# EAGLE design Hex_shield (EAGLE 9.0.1)
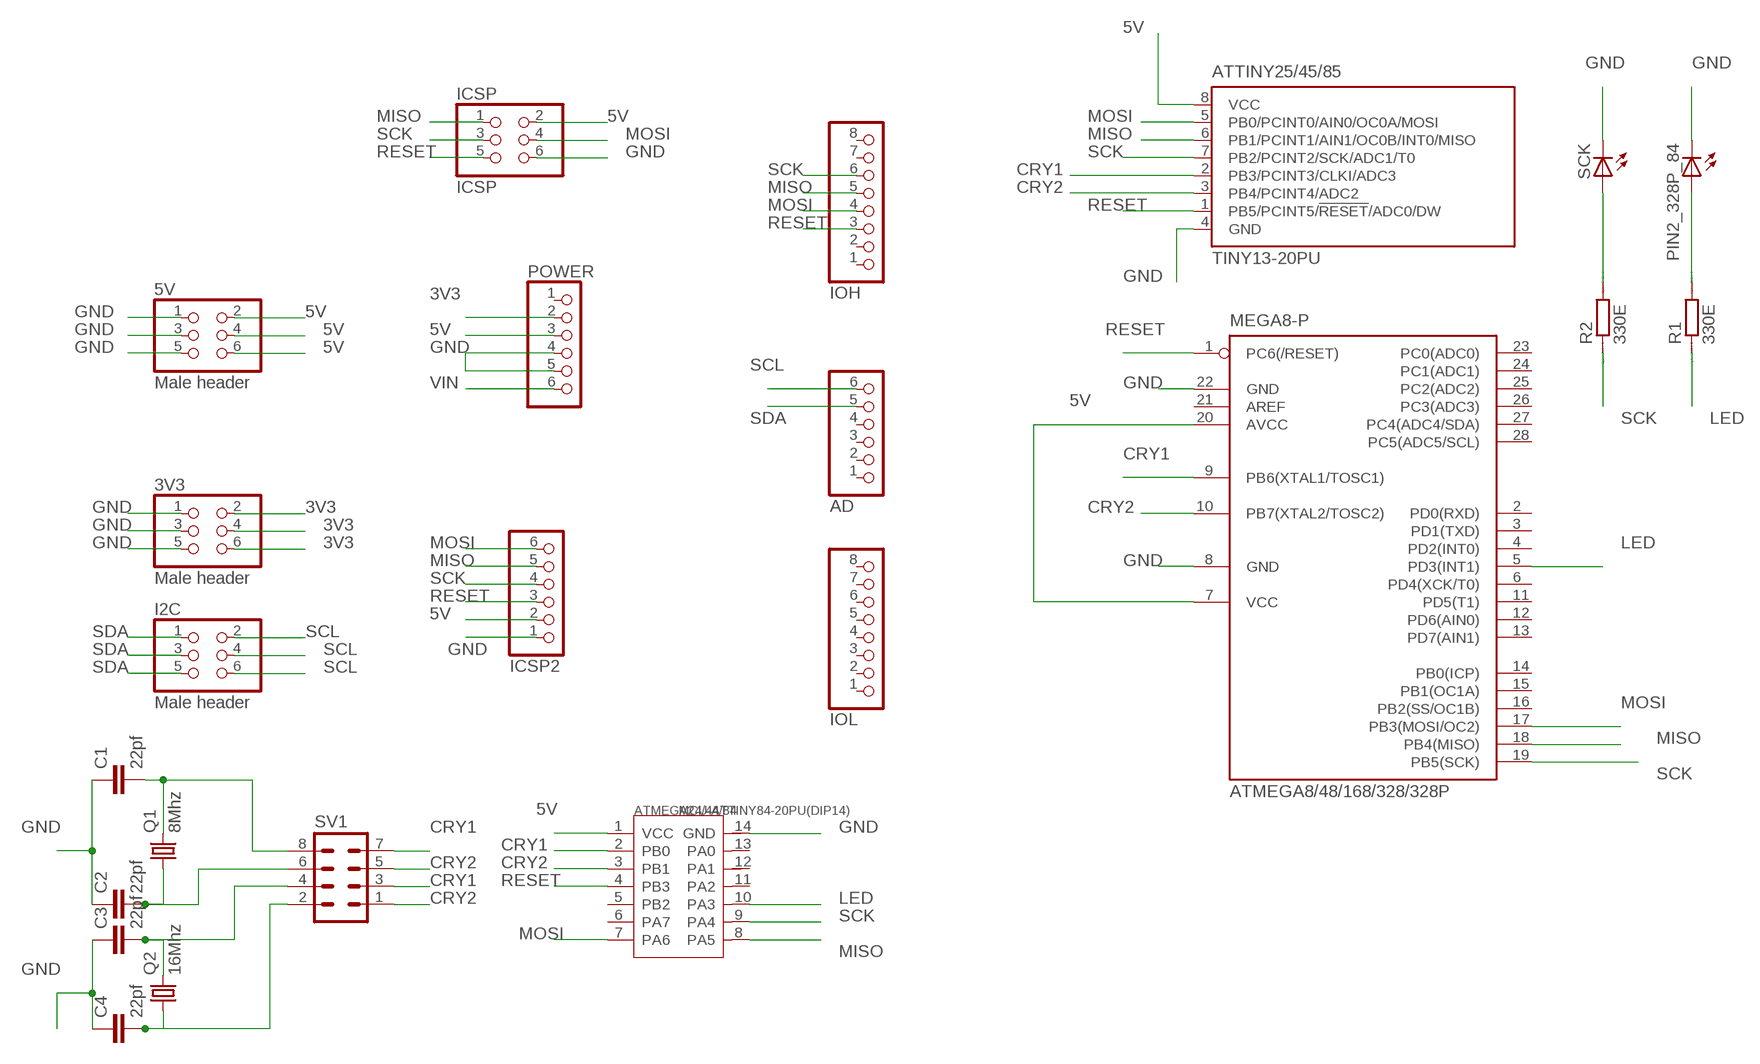
[diagram p0: schematic, sheet 1]

## Parts
3V3  Male header  PINHD-2X3  [2X03]
5V  Male header  PINHD-2X3  [2X03]
AD  PINHD-1X6  [1X06]
ATMEGA8/48/168/328/328P  MEGA8-P  [DIL28-3]
ATMEGA24/44/84  MCU-ATTINY84-20PU(DIP14)  [DIP14-2.54-17.24X6.35MM]
ATTINY25/45/85  TINY13-20PU  [DIL08]
C1  22pf  C2.5/2  [C2.5-2]
C2  22pf  C2.5/2  [C2.5-2]
C3  22pf  C2.5/2  [C2.5-2]
C4  22pf  C2.5/2  [C2.5-2]
I2C  Male header  PINHD-2X3  [2X03]
ICSP  ICSP  PINHD-2X3  [2X03]
ICSP2  PINHD-1X6  [1X06]
IOH  PINHD-1X8  [1X08]
IOL  PINHD-1X8  [1X08]
PIN2_328P_84  LED5MM  [LED5MM]
POWER  PINHD-1X6  [1X06]
Q1  8Mhz  CRYSTALHC49S  [HC49/S]
Q2  16Mhz  CRYSTALHC49S  [HC49/S]
R1  330E  R0204/7  [0204/7]
R2  330E  R0204/7  [0204/7]
SCK  LED5MM  [LED5MM]
SV1  MA04-2  [MA04-2]

## Nets
3V3: 3V3.2 3V3.4 3V3.6 POWER.2
5V: 5V.2 5V.4 5V.6 ATMEGA8/48/168/328/328P.7(VCC) ATMEGA8/48/168/328/328P.20(AVCC) ATMEGA24/44/84.1(VCC) ATTINY25/45/85.8(VCC) ICSP2.2 ICSP.2 POWER.3
CRY1: ATMEGA8/48/168/328/328P.9(PB6(XTAL1/TOSC1)) ATMEGA24/44/84.2(PB0) ATTINY25/45/85.2(PB3/PCINT3/CLKI/ADC3) SV1.3 SV1.7
CRY2: ATMEGA8/48/168/328/328P.10(PB7(XTAL2/TOSC2)) ATMEGA24/44/84.3(PB1) ATTINY25/45/85.3(PB4/PCINT4/ADC2) SV1.1 SV1.5
GND: 3V3.1 3V3.3 3V3.5 5V.1 5V.3 5V.5 ATMEGA8/48/168/328/328P.8(GND) ATMEGA8/48/168/328/328P.22(GND) ATMEGA24/44/84.14(GND) ATTINY25/45/85.4(GND) C1.1 C2.1 C3.1 C4.1 ICSP2.1 ICSP.6 PIN2_328P_84.K(C) POWER.4 POWER.5 SCK.K(C)
LED: ATMEGA8/48/168/328/328P.5(PD3(INT1)) ATMEGA24/44/84.10(PA3) R1.1
MISO: ATMEGA8/48/168/328/328P.18(PB4(MISO)) ATMEGA24/44/84.8(PA5) ATTINY25/45/85.6(PB1/PCINT1/AIN1/OC0B/INT0/MISO) ICSP2.5 ICSP.1 IOH.5
MOSI: ATMEGA8/48/168/328/328P.17(PB3(MOSI/OC2)) ATMEGA24/44/84.7(PA6) ATTINY25/45/85.5(PB0/PCINT0/AIN0/OC0A/MOSI) ICSP2.6 ICSP.4 IOH.4
N$1: C3.2 Q2.2 SV1.4
N$2: C4.2 Q2.1 SV1.2
N$3: R2.2 SCK.A
N$4: PIN2_328P_84.A R1.2
N$5: C1.2 Q1.2 SV1.8
N$6: C2.2 Q1.1 SV1.6
RESET: ATMEGA8/48/168/328/328P.1(PC6(/RESET)) ATMEGA24/44/84.4(PB3) ATTINY25/45/85.1(PB5/PCINT5/!RESET!/ADC0/DW) ICSP2.3 ICSP.5 IOH.3
SCK: ATMEGA8/48/168/328/328P.19(PB5(SCK)) ATMEGA24/44/84.9(PA4) ATTINY25/45/85.7(PB2/PCINT2/SCK/ADC1/T0) ICSP2.4 ICSP.3 IOH.6 R2.1
SCL: AD.6 I2C.2 I2C.4 I2C.6
SDA: AD.5 I2C.1 I2C.3 I2C.5
VIN: POWER.6
Unconnected: AD.1 AD.2 AD.3 AD.4 ATMEGA8/48/168/328/328P.2(PD0(RXD)) ATMEGA8/48/168/328/328P.3(PD1(TXD)) ATMEGA8/48/168/328/328P.4(PD2(INT0)) ATMEGA8/48/168/328/328P.6(PD4(XCK/T0)) ATMEGA8/48/168/328/328P.11(PD5(T1)) ATMEGA8/48/168/328/328P.12(PD6(AIN0)) ATMEGA8/48/168/328/328P.13(PD7(AIN1)) ATMEGA8/48/168/328/328P.14(PB0(ICP)) ATMEGA8/48/168/328/328P.15(PB1(OC1A)) ATMEGA8/48/168/328/328P.16(PB2(SS/OC1B)) ATMEGA8/48/168/328/328P.21(AREF) ATMEGA8/48/168/328/328P.23(PC0(ADC0)) ATMEGA8/48/168/328/328P.24(PC1(ADC1)) ATMEGA8/48/168/328/328P.25(PC2(ADC2)) ATMEGA8/48/168/328/328P.26(PC3(ADC3)) ATMEGA8/48/168/328/328P.27(PC4(ADC4/SDA)) ATMEGA8/48/168/328/328P.28(PC5(ADC5/SCL)) ATMEGA24/44/84.5(PB2) ATMEGA24/44/84.6(PA7) ATMEGA24/44/84.11(PA2) ATMEGA24/44/84.12(PA1) ATMEGA24/44/84.13(PA0) IOH.1 IOH.2 IOH.7 IOH.8 IOL.1 IOL.2 IOL.3 IOL.4 IOL.5 IOL.6 IOL.7 IOL.8 POWER.1

## Library data of the parts
3V3 5V I2C ICSP = pinhead:PINHD-2X3: PIN HEADER
AD ICSP2 POWER = pinhead:PINHD-1X6: PIN HEADER
ATMEGA8/48/168/328/328P = atmel:MEGA8-P: MICROCONTROLLER 8 Kbytes FLASH, 1 kbytes SRAM, 512 bytes EEPROM, USART, 4-channel 10 bit ADC, 2-channel 8 bit ADC Pin compatible with Atmega48, ATMega88, ATMega168 Source: avr.lbr; OC_FARNELL: unknown; OC_NEWARK: unknown
ATMEGA24/44/84 = MCU-ATTINY84-20PU_DIP14_:MCU-ATTINY84-20PU(DIP14): 310010126 Check prices <https://pricing.snapeda.com/parts/ATTINY84-20PU/Microchip/view-part?ref=eda>; AVAILABILITY: In Stock; DESCRIPTION: AVR AVR® ATtiny Microcontroller IC 8-Bit 20MHz 8KB (4K x 16) FLASH 14-PDIP; MF: Microchip; MP: ATTINY84-20PU; PACKAGE: DIP-14 Microchip; PRICE: None
ATTINY25/45/85 = atmel:TINY13: 8-bit AVR Microcontroller with 1K Bytes In-System Programmable Flash Source: http://www.atmel.com/dyn/resources/prod_documents/2535S.pdf; MPN: ATTINY13-20PU; OC_FARNELL: 9171550; OC_NEWARK: 96K6521
C1-C4 = capacitor-wima:C: CAPACITOR naming: grid - package width
IOH IOL = pinhead:PINHD-1X8: PIN HEADER
PIN2_328P_84 SCK = led:LED: LED OSRAM: - CHIPLED LG R971, LG N971, LY N971, LG Q971, LY Q971, LO R971, LY R971 LH N974, LH R974 LS Q976, LO Q976, LY Q976 LO Q996 - Hyper CHIPLED LW Q18S LB Q993, LB Q99A, LB R99A - SideLED LS A670, LO A670, LY A670, LG A670, LP A670 LB A673, LV A673, LT A673, LW A673 LH A674 LY A675 LS A676, LA A676, LO A676, LY A676, LW A676 LS A679, LY A679, LG A679 - Hyper Micro SIDELED® LS Y876, LA Y876, LO Y876, LY Y876 LT Y87S - SmartLED LW L88C, LW L88S LB L89C, LB L89S, LG L890 LS L89K, LO L89K, LY L89K LS L896, LA L896, LO L896, LY L896 - TOPLED LS T670, LO T670, LY T670, LG T670, LP T670 LSG T670, LSP T670, LSY T670, LOP T670, LYG T670 LG T671, LOG T671, LSG T671 LB T673, LV T673, LT T673, LW T673 LH T674 LS T676, LA T676, LO T676, LY T676, LB T676, LH T676, LSB T676, LW T676 LB T67C, LV T67C, LT T67C, LS T67K, LO T67K, LY T67K, LW E67C LS E67B, LA E67B, LO E67B, LY E67B, LB E67C, LV E67C, LT E67C LW T67C LS T679, LY T679, LG T679 LS T770, LO T770, LY T770, LG T770, LP T770 LB T773, LV T773, LT T773, LW T773 LH T774 LS E675, LA E675, LY E675, LS T675 LS T776, LA T776, LO T776, LY T776, LB T776 LHGB T686 LT T68C, LB T68C - Hyper Mini TOPLED® LB M676 - Mini TOPLED Santana® LG M470 LS M47K, LO M47K, LY M47K Source: http://www.osram.convergy.de LUXEON: - LUMILED® LXK2-PW12-R00, LXK2-PW12-S00, LXK2-PW14-U00, LXK2-PW14-V00 LXK2-PM12-R00, LXK2-PM12-S00, LXK2-PM14-U00 LXK2-PE12-Q00, LXK2-PE12-R00, LXK2-PE12-S00, LXK2-PE14-T00, LXK2-PE14-U00 LXK2-PB12-K00, LXK2-PB12-L00, LXK2-PB12-M00, LXK2-PB14-N00, LXK2-PB14-P00, LXK2-PB14-Q00 LXK2-PR12-L00, LXK2-PR12-M00, LXK2-PR14-Q00, LXK2-PR14-R00 LXK2-PD12-Q00, LXK2-PD12-R00, LXK2-PD12-S00 LXK2-PH12-R00, LXK2-PH12-S00 LXK2-PL12-P00, LXK2-PL12-Q00, LXK2-PL12-R00 Source: www.luxeon.com KINGBRIGHT: KA-3528ASYC Source: www.kingbright.com
Q1 Q2 = crystal:CRYSTAL: CRYSTAL; OC_FARNELL: 1667008; OC_NEWARK: unknown
R1 R2 = eagle-ltspice:R: RESISTOR, European symbol; SPICEMODEL: NONE; SPICEPREFIX: R
SV1 = con-lstb:MA04-2: PIN HEADER; OC_FARNELL: unknown; OC_NEWARK: unknown

## Net classes
0 default: width 0.152 mm, clearance 0.152 mm
1 power: width 0.406 mm, drill 0.61 mm, clearance 0.152 mm
2 gnd: width 0.203 mm, drill 0.559 mm, clearance 0.152 mm
3 usbvcc: width 0.203 mm, drill 0.61 mm, clearance 0.152 mm
4 aref: width 0.203 mm, drill 0.61 mm, clearance 0.152 mm

## Board
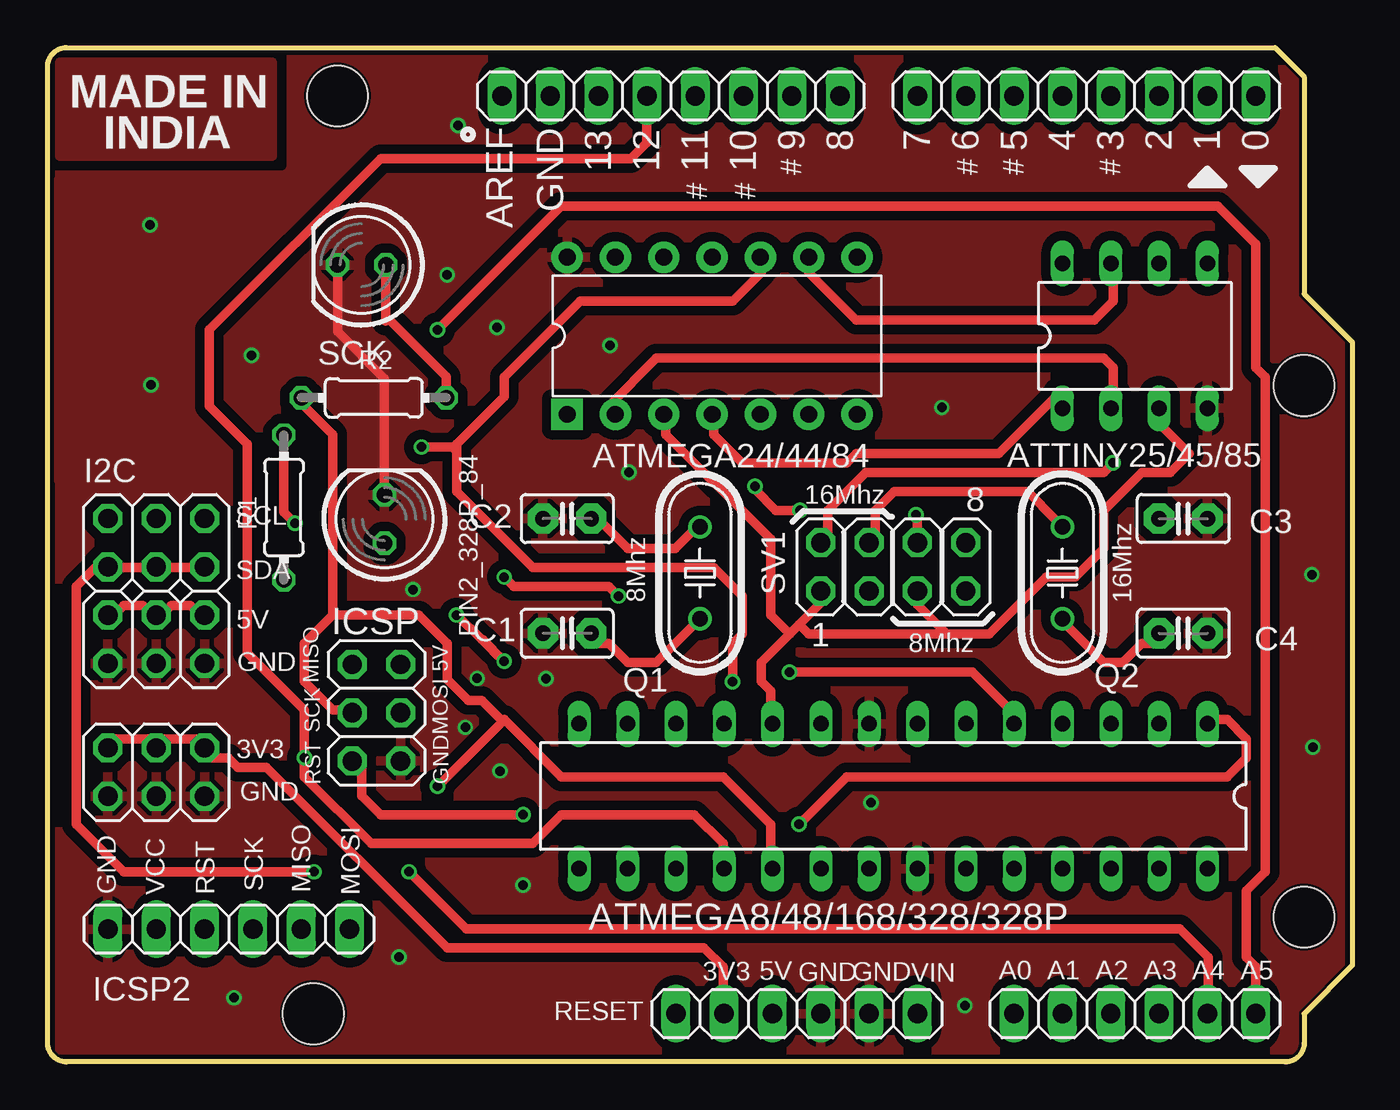
[diagram p1: board, top side]
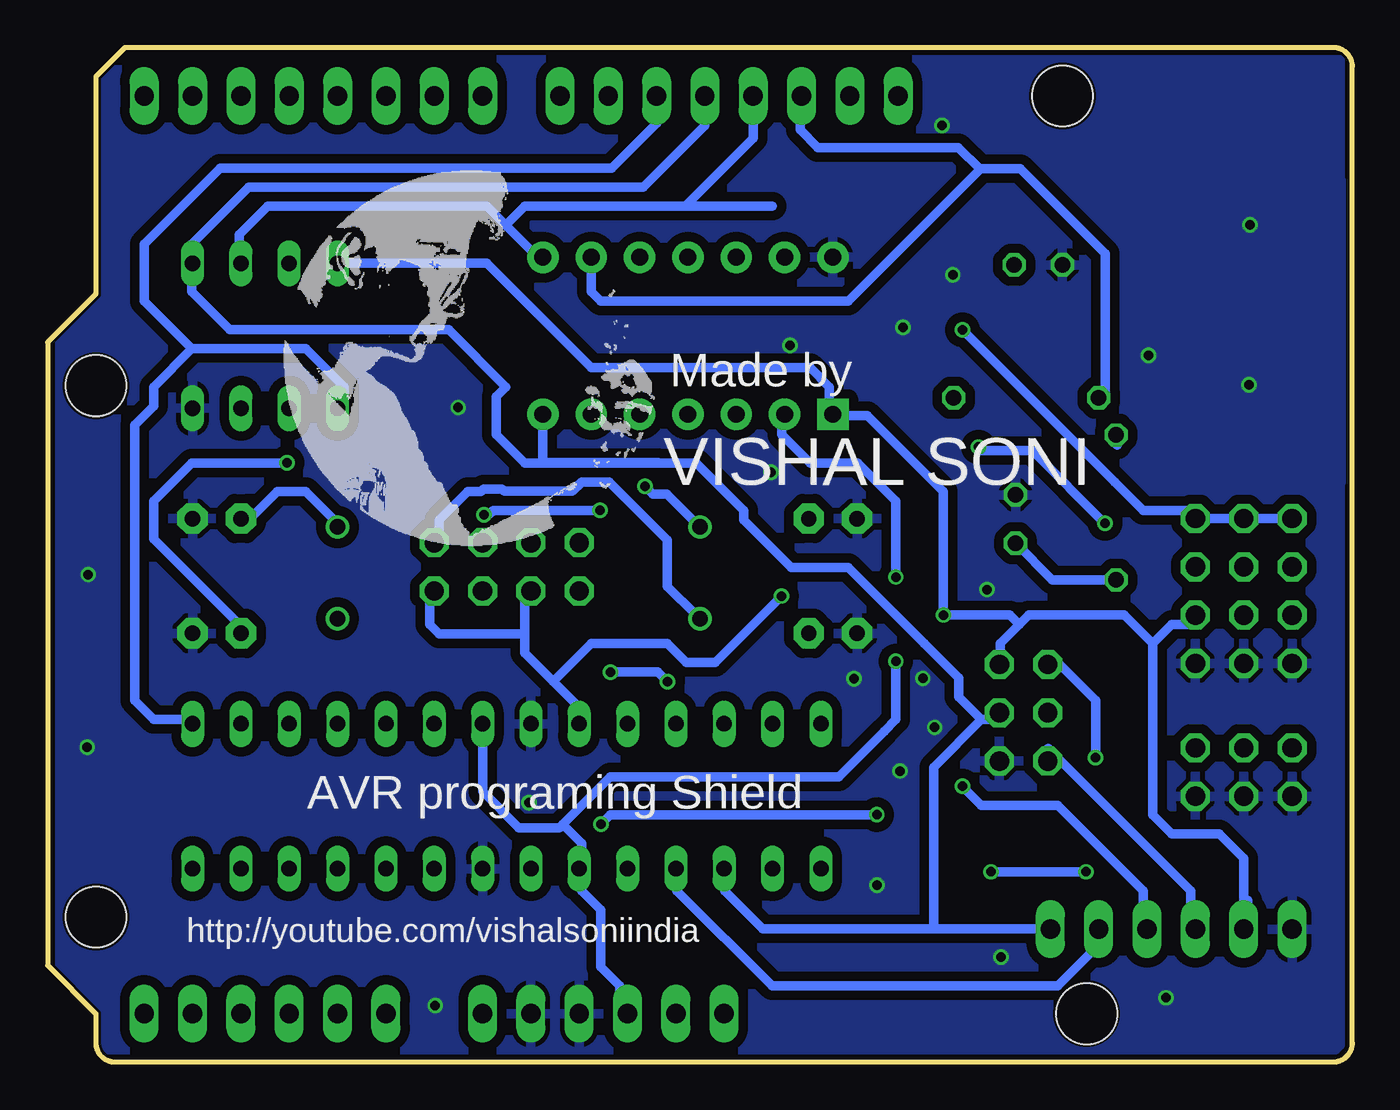
[diagram p2: board, bottom side, seen from below]

Size 68.58 x 53.34 mm. Coordinates in mm from the lower left corner, seen from the top.
Outline: 64.52,53.34 66.04,51.82 66.04,40.39 68.58,37.85 68.58,5.08 66.04,2.54 66.04,1 arc-90 65.04,0 1,0 arc-90 0,1 0,52.34 arc-90 1,53.34 64.52,53.34
Copper layers (1*16): Top 0.035mm / dielectric 1.5mm / Bottom 0.035mm
Design rules "default *": minimum track width 0.5mm, minimum drill 0.5mm, track to track 0.5mm, track to pad 0.5mm, pad to pad 0.5mm, via to via 0.5mm, smd to smd 6mil, copper to edge 6mil, drill to drill 6mil, minimum pad ring 6mil, minimum via ring 6mil, stop-mask expansion 1mil, vias tented up to drill 20mil, thermal gap 10mil
Holes 3.2 mm at 66.04,35.56 66.04,7.62 15.24,50.8 13.97,2.54
vRestrict: area 22.9,44.1 to 24.6,49.1; area 25.4,45.5 to 27.1,49.1; area 28.4,45.3 to 29.6,48.8; area 31,45.3 to 32.1,48.8; area 33.5,45.3 to 34.7,48.8; area 36.1,45.3 to 37.2,48.8; area 38.7,47.2 to 39.9,48.8; area 40.3,45.1 to 47.6,46.9; area 60.3,44.2 to 61.7,46.7; area 62.9,44.2 to 64.3,46.7; area 61.3,35.8 to 64.8,37.2; area 0.6,21.8 to 2,30.1; 14 more areas

### Footprints (pad centres in the part's own frame; a part is rotated, then mirrored left to right if it is on the bottom)
2X03 = drill 1.016 octagon: 1 -2.54,-1.27; 2 -2.54,1.27; 3 0,-1.27; 4 0,1.27; 5 2.54,-1.27; 6 2.54,1.27
1X06 = drill 1.016 long: 1 -6.35,0; 2 -3.81,0; 3 -1.27,0; 4 1.27,0; 5 3.81,0; 6 6.35,0
DIL28-3 = drill 0.813 long: 1 -16.51,-3.81; 2 -13.97,-3.81; 3 -11.43,-3.81; 4 -8.89,-3.81; 5 -6.35,-3.81; 6 -3.81,-3.81; 7 -1.27,-3.81; 8 1.27,-3.81; 9 3.81,-3.81; 10 6.35,-3.81; 11 8.89,-3.81; 12 11.43,-3.81; 13 13.97,-3.81; 14 16.51,-3.81; 15 16.51,3.81; 16 13.97,3.81; 17 11.43,3.81; 18 8.89,3.81; 19 6.35,3.81; 20 3.81,3.81; 21 1.27,3.81; 22 -1.27,3.81; 23 -3.81,3.81; 24 -6.35,3.81; 25 -8.89,3.81; 26 -11.43,3.81; 27 -13.97,3.81; 28 -16.51,3.81
DIP14-2.54-17.24X6.35MM = drill 0.889 pad 1.651 square: 1 -7.62,-4.128 | drill 0.889 pad 1.651: 2 -5.08,-4.128; 3 -2.54,-4.128; 4 0,-4.128; 5 2.54,-4.128; 6 5.08,-4.128; 7 7.62,-4.128; 8 7.62,4.128; 9 5.08,4.128; 10 2.54,4.128; 11 0,4.128; 12 -2.54,4.128; 13 -5.08,4.128; 14 -7.62,4.128
DIL08 = drill 0.813 long: 1 -3.81,-3.81; 2 -1.27,-3.81; 3 1.27,-3.81; 4 3.81,-3.81; 5 3.81,3.81; 6 1.27,3.81; 7 -1.27,3.81; 8 -3.81,3.81
C2.5-2 = drill 0.813 pad 1.6 octagon: 1 -1.27,0; 2 1.27,0
1X08 = drill 1.016 long: 1 -8.89,0; 2 -6.35,0; 3 -3.81,0; 4 -1.27,0; 5 1.27,0; 6 3.81,0; 7 6.35,0; 8 8.89,0
LED5MM = drill 0.813 octagon: A -1.27,0; K 1.27,0
HC49/S = drill 0.813: 1 -2.413,0; 2 2.413,0
0204/7 = drill 0.813 octagon: 1 -3.81,0; 2 3.81,0
MA04-2 = drill 1.016 octagon: 1 -3.81,-1.27; 2 -3.81,1.27; 3 -1.27,-1.27; 4 -1.27,1.27; 5 1.27,-1.27; 6 1.27,1.27; 7 3.81,-1.27; 8 3.81,1.27

### Placement (x,y rotation side)
3V3  5.71,15.24 0 top
5V  5.71,22.23 0 top
AD  57.15,2.54 0 top
ATMEGA8/48/168/328/328P  44.45,13.97 180 top
ATMEGA24/44/84  34.92,38.18 0 top
ATTINY25/45/85  57.15,38.18 0 top
C1  27.3,22.54 0 top
C2  27.3,28.57 0 top
C3  59.69,28.57 180 top
C4  59.69,22.54 180 top
I2C  5.71,27.3 0 top
ICSP  17.29,18.36 270 top
ICSP2  9.53,6.99 0 top
IOH  32.77,50.8 180 top
IOL  54.61,50.8 180 top
PIN2_328P_84  17.7,28.55 90 top
POWER  39.37,2.54 0 top
Q1  34.29,25.72 270 top
Q2  53.34,25.72 90 top
R1  12.42,29.16 270 top
R2  17.14,34.92 0 top
SCK  16.51,41.91 180 top
SV1  44.45,26.04 0 top

### Tracks (layer width: path | path; a pad name or v marks a point on that pad's centre or on a via)
3V3
  Top 0.5: 3V3.2 3.5,17 5.5,17 3V3.4 6,17 8,17 3V3.6 8,16.5 8.5,16 9.5,16 10,15.5 11.5,15.5 21,6 34.5,6 35.5,5 35.5,3 POWER.2
5V  (via drill 0.5)
  Top 0.5: 5V.2 3.5,23.5 4,24 5,24 5.5,23.5 5V.4 6,23.5 6.5,24 7.5,24 8,23.5 5V.6 | v21.5,23.5 22.83,22.2 23.41,21.64 v24,21.07
  Top 0.508: 22.83,22.2 22.86,22.2 v24,21.07
  Bottom 0.5: ATTINY25/45/85.8 53,42 45.5,42 40,36.5 28.5,36.5 27.5,35.5 27.5,34.5 ATMEGA24/44/84.1 27,34 25.5,34 21.5,30 v21.5,23.5 18,23.5 17.5,23 | POWER.3 38.5,3 38.5,4 39.5,5 39.5,8 40.5,9 40.5,10 ATMEGA8/48/168/328/328P.20 40.5,10.5 40.5,11.5 41.5,12.5 39,15 27,15 24.61,17.39 | 46,17.5 ATMEGA8/48/168/328/328P.7 | 5.5,8.5 5.5,7 ICSP2.2 | 7,12 9.5,12 10.5,13 10.5,22 | 10.5,22 9.5,23 8.5,23 5V.6 | 17.5,23 17,23.5 12,23.5 10.5,22 | 17.5,23 18.5,22 18.5,21 ICSP.2 | 24,18 24.61,17.39 | v24,21.07 24,18 | 24,18 | 24.61,17.39
  Bottom 0.508: ATMEGA8/48/168/328/328P.7 45.72,14.22 43.82,12.32 41.68,12.32 41.5,12.5 | ICSP2.2 5.71,10.71 7,12
CRY1  (via drill 0.5)
  Top 0.5: ATTINY25/45/85.2 56,34.5 56,36.5 55.5,37 32,37 29.5,34.5 ATMEGA24/44/84.2 | v30,24.5 29.5,25 24.5,25 v24,25.5
  Bottom 0.5: 42,20 43.5,21.5 43.5,22.5 | 42,20 40.5,18.5 40.5,18 ATMEGA8/48/168/328/328P.9 | 43.5,22.5 43.5,24.5 SV1.3 | 43.5,22.5 48,22.5 48.5,23 48.5,24.5 SV1.7 | 42,20 40,22 36,22 35,21 33.5,21 v30,24.5 | v24,25.5 24,29.5 26,31.5 28.5,31.5 30,33 30,34 ATMEGA24/44/84.2
CRY2
  Top 0.5: 47,22.5 47.27,22.5 49.5,22.5 52.5,25.5 54,25.5 55.5,27 55.5,29 57.5,31 59,31 60,32 58.5,33.5 58.5,34 ATTINY25/45/85.3 | 39.5,23 41,24.5 SV1.1 | 39.5,23 39,22.5 | 39,22.5 37.5,21 37.5,20 38,19.5 38,18 ATMEGA8/48/168/328/328P.10 | 39,22.5 38,23.5 38,27.5 32.5,33 32.5,34 ATMEGA24/44/84.3 | 46,22.5 45.72,22.5 40,22.5 39.5,23
  Top 0.508: 45.72,22.5 47,22.5 | SV1.5 45.72,24.05 47.27,22.5
GND  (via drill 0.5)
  Top 0.508: PIN2_328P_84.K 17.7,35.94 15.24,38.41 SCK.K
  other vias: 21.96,17.59 21.56,49.24 21,41.39 29.55,37.68 30.57,31.01 26.2,20.15 23.77,15.3 47,34.41 9.8,3.38 18.47,5.51 66.45,25.63 66.5,16.56 48.21,2.97 43.28,13.64 24.99,9.3 19.2,24.84 22.58,20.17 5.38,44.02 5.44,35.61 23.62,38.63 10.72,37.16
  pour Bottom (rank 2): 0.64,52.7 67.69,52.7 67.94,52.45 67.94,0.64 0.89,0.64 0.64,0.89 0.64,30.48 0.59,30.48 0.59,46.35 0.64,46.35
  pour Top (rank 2): 0.64,52.7 67.94,52.7 67.94,0.64 0.64,0.64 0.64,30.48 0.59,30.55 0.59,46.42 0.64,46.35
LED  (via drill 0.5)
  Top 0.5: ATMEGA24/44/84.10 37.5,42 37.5,41.5 36,40 28,40 24,36 24,35 21.5,32.5 21.5,32.11 21.5,30 25.5,26 35,26 36.5,24.5 36.5,22.5 36,22 v36,20
  Top 0.508: v39,20.5 48.61,20.5 50.8,18.31 ATMEGA8/48/168/328/328P.5 | v19.66,32.33 21.27,32.33 21.5,32.11 | R1.1 12.42,28.91 v13.01,28.32
  Bottom 0.5: v39,20.5 36.5,20.5 v36,20
  Bottom 0.508: 12.37,32.44 12.42,32.49 R1.1 | v13.01,28.32 16.84,32.16 19.48,32.16 v19.66,32.33
MISO  (via drill 0.5)
  Top 0.5: ATMEGA8/48/168/328/328P.18 35.5,10.5 35.5,11.5 34,13 27,13 25.5,11.5 17,11.5 13.5,15 v13.5,16 13.5,18.5 10.5,21.5 10.5,32.5 8.5,34.5 8.5,38.5 17.5,47.5 25,47.5
  Top 0.508: 25,47.5 30.66,47.5 31.5,48.34 IOH.5
  Bottom 0.5: ATMEGA8/48/168/328/328P.18 35.5,10 35.5,9 30.5,4 15.5,4 13,6.5 ICSP2.5 | v13.5,16 13.5,19 15.5,21 16,21 ICSP.1 | 44.5,44 43,42.5 ATMEGA24/44/84.8 | 44.5,44 45.5,45 57,45 58.5,43.5 58.5,42 ATTINY25/45/85.6 | 30.5,45 35.08,45 43.5,45 44.5,44
  Bottom 0.508: 35.08,45 31.5,48.58 IOH.5
MOSI
  Bottom 0.5: 22,7 16,7 ICSP2.6 | 22,7 31,7 33,9 33,10 ATMEGA8/48/168/328/328P.17 | 22,7 22,15.5 19.5,18 19,18 ICSP.4 | 37.26,46 58,46 61,43 61,42 ATTINY25/45/85.5 61,41.5 61,40.5 59,38.5 47.5,38.5 44.5,35.5 45,35 45,33 43.5,31.5 | 22.5,22 26.5,26 29.5,26 32,28.5 32,29 34.5,31.5
  Bottom 0.508: 22.5,22 20.69,20.19 20.69,19.19 19.5,18 | 37.26,46 34.04,49.23 IOH.4 | 34.5,31.5 36.45,31.5 | 36.45,31.5 38.63,31.5 38.64,31.5 40.93,31.5 40.94,31.5 42.52,31.5 | 42.52,31.5 43.5,31.5 | ATMEGA24/44/84.7 42.55,31.52 | 42.55,31.52 42.52,31.5 | 36.45,31.5 36.47,31.52 42.55,31.52
N$1
  Top 0.5: 43.5,29 43.5,27.5 SV1.4 | 53,28.5 Q2.2
  Top 0.508: 43.5,29 44.5,30 51.5,30 53,28.5
  Bottom 0.5: Q2.2 53.5,28.5 55,30 56.5,30 58,28.5 C3.2
N$2  (via drill 0.5)
  Top 0.5: Q2.1 53.5,23 55.5,21 56.5,21 57.5,22 58.5,22 58.5,22.5 C4.2 | v56,31.5 55.5,31 43,31 41,29 41,27.5 SV1.2
  Bottom 0.5: v56,31.5 61,31.5 63,29.5 63,27.5 58.5,23 C4.2
N$3
  Top 0.508: SCK.A 17.78,39.22 | 17.78,39.22 17.78,38.96 | 17.78,39.22 20.95,36.04 R2.2
N$4
  Bottom 0.508: PIN2_328P_84.A 15.77,25.35 R1.2
N$5
  Top 0.5: Q1.2 34,23 32,21 30.5,21 29.5,22 28.5,22 28.5,22.5 C1.2
  Bottom 0.5: 46.5,30 48,28.5 48,27.5 SV1.8 | 36,26 36,25 34.5,23.5 Q1.2
  Bottom 0.508: 46.5,30 45.8,30 45.67,30.14 44.71,30.14 44.59,30.02 41,30.02 40.51,30.5 39.06,30.5 36,27.44 36,26
N$6  (via drill 0.5)
  Top 0.5: Q1.1 34,28 33,27 30.5,27 29,28.5 C2.2 28.5,29 | 46,27.5 SV1.6
  Top 0.508: v39.55,29.01 38.28,29.01 37.19,30.1 v37.19,30.28 | SV1.6 45.72,28.7 v45.64,28.78
  Bottom 0.508: 43.61,29.01 45.16,29.01 45.39,28.78 v45.64,28.78 | 43.61,29.01 v39.55,29.01 | Q1.1 36.03,29.87 36.78,29.87 v37.19,30.28 | 43.61,29.01
N$27
  pour Top: 0.64,52.58 11.81,52.58 11.81,47.62 0.64,47.62
RESET  (via drill 0.5)
  Top 0.5: 36.5,31.5 35,33 35,34 ATMEGA24/44/84.4 | 42,31.5 42.5,32 50,32 53,35 53.5,34.5 ATTINY25/45/85.1 | v25,13 17.5,13 16.5,14 16.5,15.5 ICSP.5 | v39.5,12.5 42,15 | 62,15 63,16 63,17 62,18 61,18 ATMEGA8/48/168/328/328P.1
  Top 0.508: 42,15 62,15 | 36.5,31.5 42,31.5
  Bottom 0.5: ICSP2.3 8.5,7 8.5,9 16,16.5 16.5,16 ICSP.5 | 61,37.5 63,35.5 63,34.5 64,33.5 64,19 63,18 61,18 ATMEGA8/48/168/328/328P.1 | 61,37.5 55,37.5 53,35.5 53,34.5 ATTINY25/45/85.1 | 38.94,47 59.5,47 63.5,43 63.5,40 61,37.5 | v25,13 39,13 v39.5,12.5
  Bottom 0.508: 38.94,47 36.58,49.36 IOH.3
SCK  (via drill 0.5)
  Top 0.127: 47.24,39 47.24,38.81
  Top 0.5: 47.24,39 42.5,39 40,41.5 40,42 ATMEGA24/44/84.9 | 47.6,39 55,39 56,40 56,41.5 ATTINY25/45/85.7 | 21,21 21,22 19.5,23.5 15,23.5 | 15,23.5 13.5,22 13.5,20 15,18.5 16,18.5 ICSP.3 | ATMEGA8/48/168/328/328P.19 38,10.5 38,12.5 35.5,15 27,15 24,18 23.92,17.92 v20.5,14.5 | 15,23.5 15,33 13.5,34.5 R2.1
  Top 0.508: 23.92,17.92 22.82,19.01 22.1,19.01 21,20.11 21,21 | 47.24,39 47.6,39
  Bottom 0.5: v20.5,14.5 19.5,13.5 15.5,13.5 11,9 11,7 ICSP2.4 | 17.47,46.97 13,42.5 13,35 R2.1 | 19.56,46.94 26.5,40 39.5,40 40,40.5 40,42 ATMEGA24/44/84.9
  Bottom 0.508: IOH.6 29.03,50.72 29.03,49.02 28.1,48.09 20.7,48.09 19.56,46.94 19.53,46.97 17.47,46.97
SCL  (via drill 0.5)
  Top 0.5: AD.6 63.5,5 63,5.5 63,9 64,10 64,36 63.5,36.5 63.5,43 61.5,45 27,45 v20.5,38.5
  Bottom 0.5: 12.5,30.5 v20.5,38.5 | 9.5,29 8.5,29 I2C.6
  Bottom 0.508: 9.5,29 11,29 12.5,30.5 | I2C.2 I2C.4 I2C.6
SDA  (via drill 0.5)
  Top 0.5: I2C.5 8,26 6,26 I2C.3 5.5,26 3.5,26 I2C.1 3,26.5 1.5,25 | v19,10 22,7 59.5,7 61,5.5 61,3 AD.5 | 4,10 v14,10
  Top 0.508: 4,10 1.5,12.5 1.5,25
  Bottom 0.5: v14,10 v19,10

### Text on the board
tPlace: MADE IN | 13 | 12 | 11 | 10 | 9 | 8 | 7 | 6 | 5 | 4 | 3 | 2 | 1 | 0 | INDIA
tNames: AREF | GND | # | # | # | # | # | # | 16Mhz | SCL | 16Mhz | SDA | 8Mhz | 8Mhz | GND | 5V | MISO | SCK | MOSI | RST | GND | GND | GND | VCC | RST | SCK | MISO | MOSI | 3V3 | 5V | VIN | GND | GND | A0 | A1 | A2 | A3 | A4 | A5 | RESET
bNames: Made by | VISHAL SONI | AVR programing Shield | http://youtube.com/vishalsoniindia
ReferenceLC: L | TX | RX | PC1 | PC2
214bmp: D:/SmartProjects/Snc/a4_bn_logo2.bmp